# EAGLE schematic p128control (EAGLE 9.6.2)
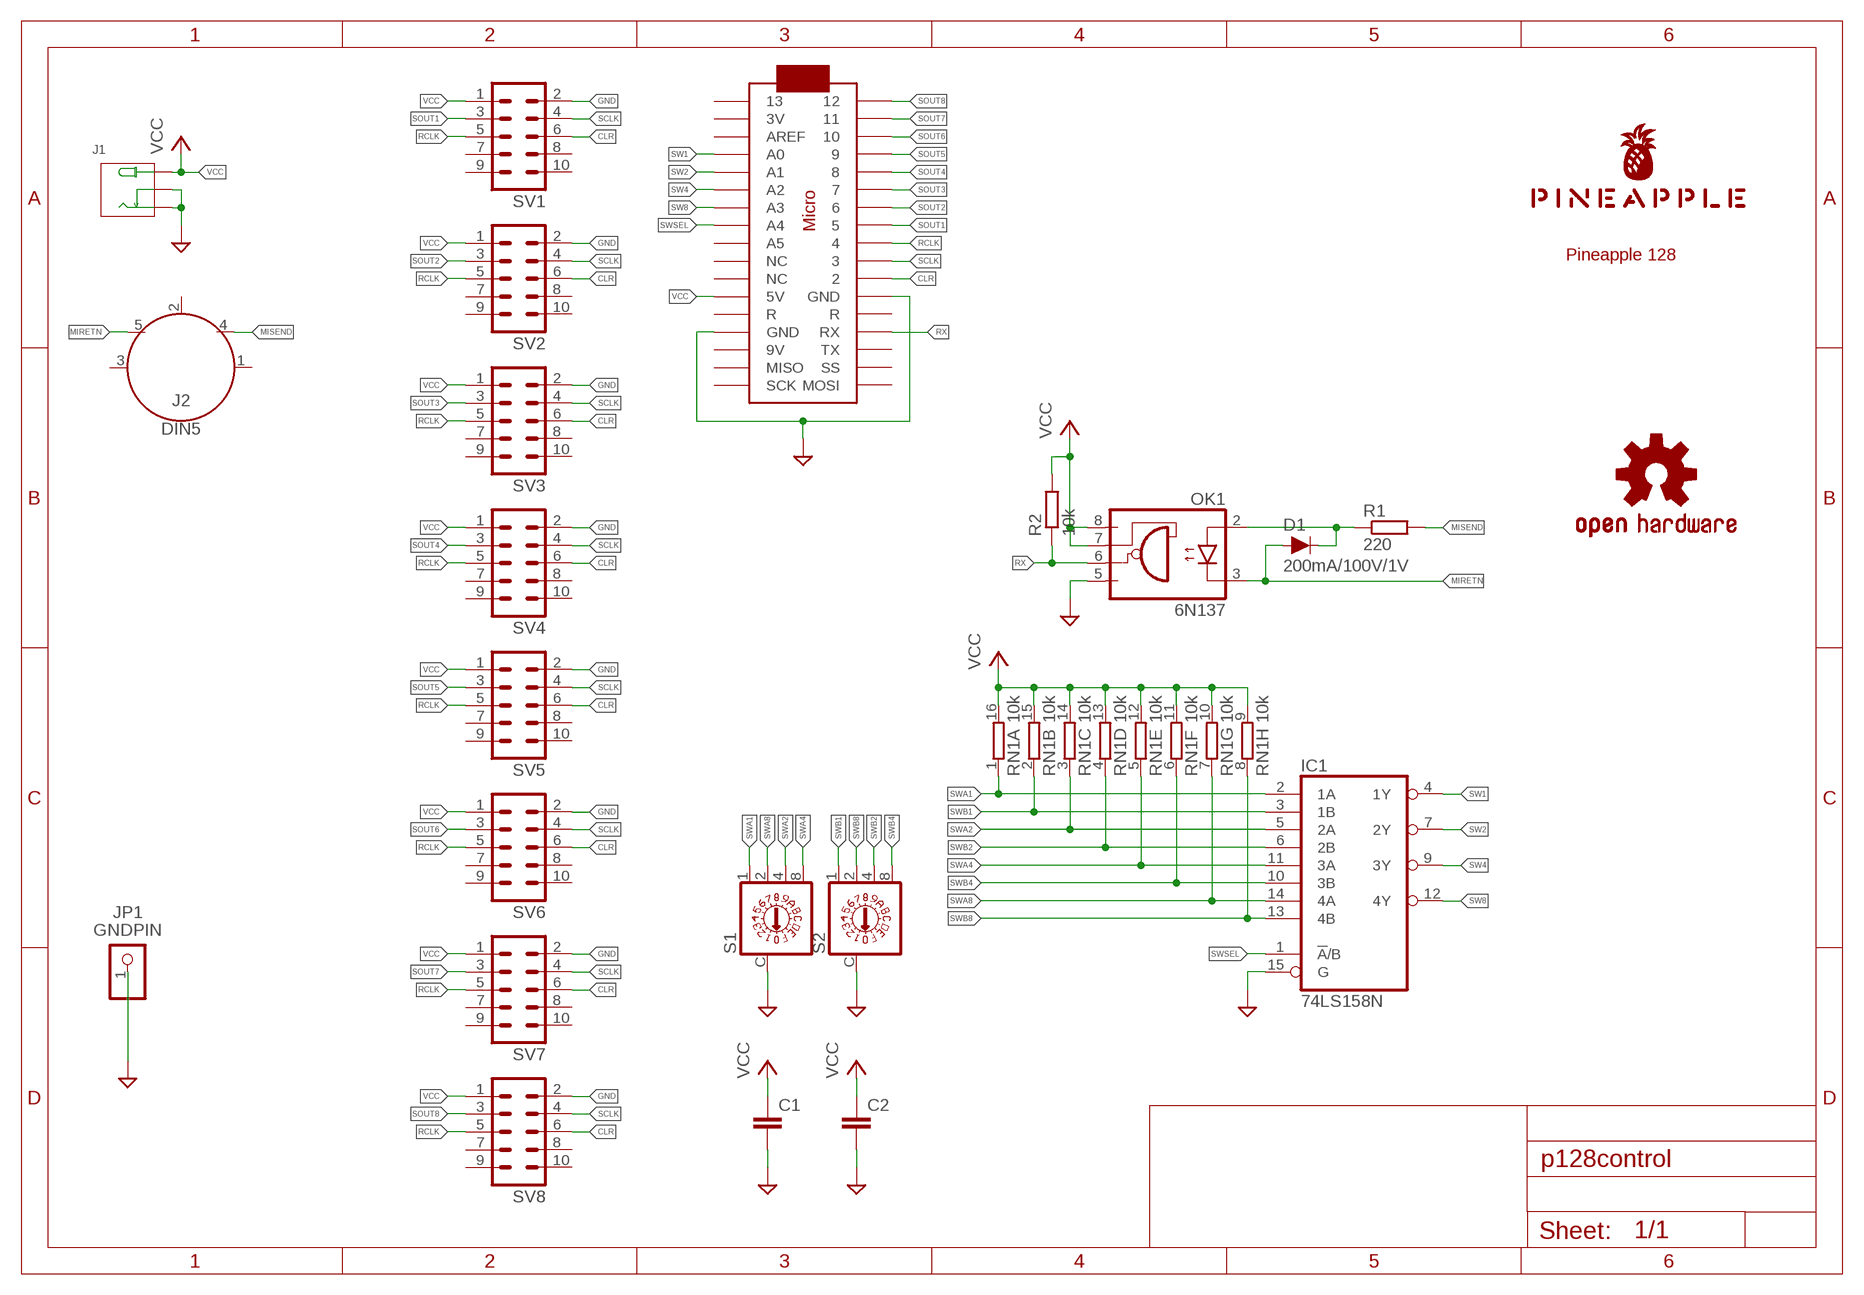
[diagram p0: schematic, sheet 1]

## Parts
C1  C-EU025-024X044  [C025-024X044]
C2  C-EU025-024X044  [C025-024X044]
D1  200mA/100V/1V  DIODE-1N4148  [DIODE-1N4148]
IC1  74LS158N  [DIL16]
J1  JACK-DC-005'DC-005'  [3P-L14.2*W11.0*H9.0MM]
J2  DIN5  [DIN5-RA-PTH]
JP1  GNDPIN  PINHD-1X1  [1X01]
LOGO1  OSHW-LOGOS-COPPER  [OSHW-LOGO-S_COPPER]
OK1  6N137  [DIL08]
R1  220  R-EU_0204/5  [0204/5]
R2  10k  R-EU_0204/5  [0204/5]
RN1  10k  8R-N  [DIL16]
S1  A1353HEX  [A1353HEX]
S2  A1353HEX  [A1353HEX]
SV1  ML10  [ML10]
SV2  ML10  [ML10]
SV3  ML10  [ML10]
SV4  ML10  [ML10]
SV5  ML10  [ML10]
SV6  ML10  [ML10]
SV7  ML10  [ML10]
SV8  ML10  [ML10]
U$1  PINEAPPLE450_SILK  [PINEAPPLE450_SILK]
U$2  ARDUINOMICRO  [ARDUINOMICRO]

## Nets
CLR: SV1.6 SV2.6 SV3.6 SV4.6 SV5.6 SV6.6 SV7.6 SV8.6 U$2.P$11
GND [gnd]: C1.2 C2.2 IC1.15(G) J1.-1(-) J1.-2(CDN) JP1.1 OK1.5(GND) S1.C S2.C SV1.2 SV2.2 SV3.2 SV4.2 SV5.2 SV6.2 SV7.2 SV8.2 U$2.P$12(GND) U$2.P$21(GND)
MIRETN: D1.A J2.5 OK1.3(C)
MISEND: J2.4 R1.2
N$1: D1.C OK1.2(A) R1.1
RCLK: SV1.5 SV2.5 SV3.5 SV4.5 SV5.5 SV6.5 SV7.5 SV8.5 U$2.P$9
RX: OK1.6(VO) R2.1 U$2.P$14(RX)
SCLK: SV1.4 SV2.4 SV3.4 SV4.4 SV5.4 SV6.4 SV7.4 SV8.4 U$2.P$10
SOUT1: SV1.3 U$2.P$8
SOUT2: SV2.3 U$2.P$7
SOUT3: SV3.3 U$2.P$6
SOUT4: SV4.3 U$2.P$5
SOUT5: SV5.3 U$2.P$4
SOUT6: SV6.3 U$2.P$3
SOUT7: SV7.3 U$2.P$2
SOUT8: SV8.3 U$2.P$1
SW1: IC1.4(1Y) U$2.P$31(A0)
SW2: IC1.7(2Y) U$2.P$30(A1)
SW4: IC1.9(3Y) U$2.P$29(A2)
SW8: IC1.12(4Y) U$2.P$28(A3)
SWA1: IC1.2(1A) RN1.1 S1.1
SWA2: IC1.5(2A) RN1.3 S1.4
SWA4: IC1.11(3A) RN1.5 S1.8
SWA8: IC1.14(4A) RN1.7 S1.2
SWB1: IC1.3(1B) RN1.2 S2.1
SWB2: IC1.6(2B) RN1.4 S2.4
SWB4: IC1.10(3B) RN1.6 S2.8
SWB8: IC1.13(4B) RN1.8 S2.2
SWSEL: IC1.1(!A!/B) U$2.P$27(A4)
VCC [power]: C1.1 C2.1 J1.+ OK1.7(VE) OK1.8(VCC) R2.2 RN1.9 RN1.10 RN1.11 RN1.12 RN1.13 RN1.14 RN1.15 RN1.16 SV1.1 SV2.1 SV3.1 SV4.1 SV5.1 SV6.1 SV7.1 SV8.1 U$2.P$23(5V)
Unconnected: J2.1 J2.2 J2.3 SV1.7 SV1.8 SV1.9 SV1.10 SV2.7 SV2.8 SV2.9 SV2.10 SV3.7 SV3.8 SV3.9 SV3.10 SV4.7 SV4.8 SV4.9 SV4.10 SV5.7 SV5.8 SV5.9 SV5.10 SV6.7 SV6.8 SV6.9 SV6.10 SV7.7 SV7.8 SV7.9 SV7.10 SV8.7 SV8.8 SV8.9 SV8.10 U$2.P$13(R) U$2.P$15(TX) U$2.P$16(SS) U$2.P$17(MOSI) U$2.P$18(SCK) U$2.P$19(MISO) U$2.P$20(9V) U$2.P$22(R) U$2.P$24(NC) U$2.P$25(NC) U$2.P$26(A5) U$2.P$32(AREF) U$2.P$33(3V) U$2.P$34

## Notes on the sheet
- Pineapple 128

## Power pins joined to a net without a drawn wire
GND: IC1.8(GND)
VCC: IC1.16(VCC)

## Library data of the parts
C1 C2 = resistor:C-EU: CAPACITOR, European symbol
D1 = SparkFun-DiscreteSemi:DIODE: Diode These are standard reverse protection diodes and small signal diodes. SparkFun Products: SparkFun SparkPunk Sound Kit <https://www.sparkfun.com/products/11177> SparkFun ESP8266 Thing <https://www.sparkfun.com/products/13231>; PROD_ID: DIO-08378
IC1 = 74xx-us:74*158: Quadruple 2-line to 1-line data SELECTOR/MULTIPLEXER
J1 = Seeed-Connector:JACK-DC-005: 320120003
J2 = SparkFun-Connectors:DIN5: DIN5 Connector - Female Right Angle (frequently used as a MIDI Jack connector) This type of connector and cable is frequently used for transmitting midi data (musical instrument digital interface). It is what you usually see on a keyboard or set of electronic drums. Learn more here <https://en.wikipedia.org/wiki/MIDI>. For more information on the pinout and electrical specifications of MIDI communications, please see the following resource: https://www.midi.org/specifications/item/midi-din-electrical-specification Here is the connector we sell at SparkFun: MIDI Connector - Female Right Angle <https://www.sparkfun.com/products/9536> (PRT-09536) Datasheet <hhttp://www.sparkfun.com/datasheets/Prototyping/Connectors/MIDI-RA.pdf> It is used on this SparkFun product: SparkFun MIDI Shield <https://www.sparkfun.com/products/12898> (DEV-12898); PROD_ID: CONN-09481
JP1 = pinhead:PINHD-1X1: PIN HEADER
LOGO1 = SparkFun-Aesthetics:OSHW-LOGO: Open-Source Hardware (OSHW) Logo This logo indicates the piece of hardware it is found on incorporates a OSHW license and/or adheres to the definition of open source hardware found here: http://freedomdefined.org/OSHW
OK1 = optocoupler:6N137: MOTOROLA OPTO COUPLER; MPN: 6N137; OC_FARNELL: 1328376; OC_NEWARK: 52M1895
R1 R2 = resistor:R-EU_: RESISTOR, European symbol
RN1 = resistor-dil:8R-N: DIL RESISTOR; OC_FARNELL: unknown; OC_NEWARK: unknown
S1 S2 = switch-dil:A1353HEX: DIL/CODE SWITCH; OC_FARNELL: unknown; OC_NEWARK: unknown
SV1-SV8 = con-ml:ML10: HARTING; OC_FARNELL: unknown; OC_NEWARK: unknown
U$1 = pineapple:PINEAPPLE450_SILK
U$2 = adafruit:ARDUINOMICRO

## Net classes
0 default: width 0.152 mm, drill 0.152 mm, clearance 0.152 mm
1 gnd: width 0.61 mm, drill 0.152 mm, clearance 0.152 mm
2 power: width 0.61 mm, drill 0.152 mm, clearance 0.152 mm
3 analog: width 0.305 mm, drill 0.152 mm, clearance 0.152 mm